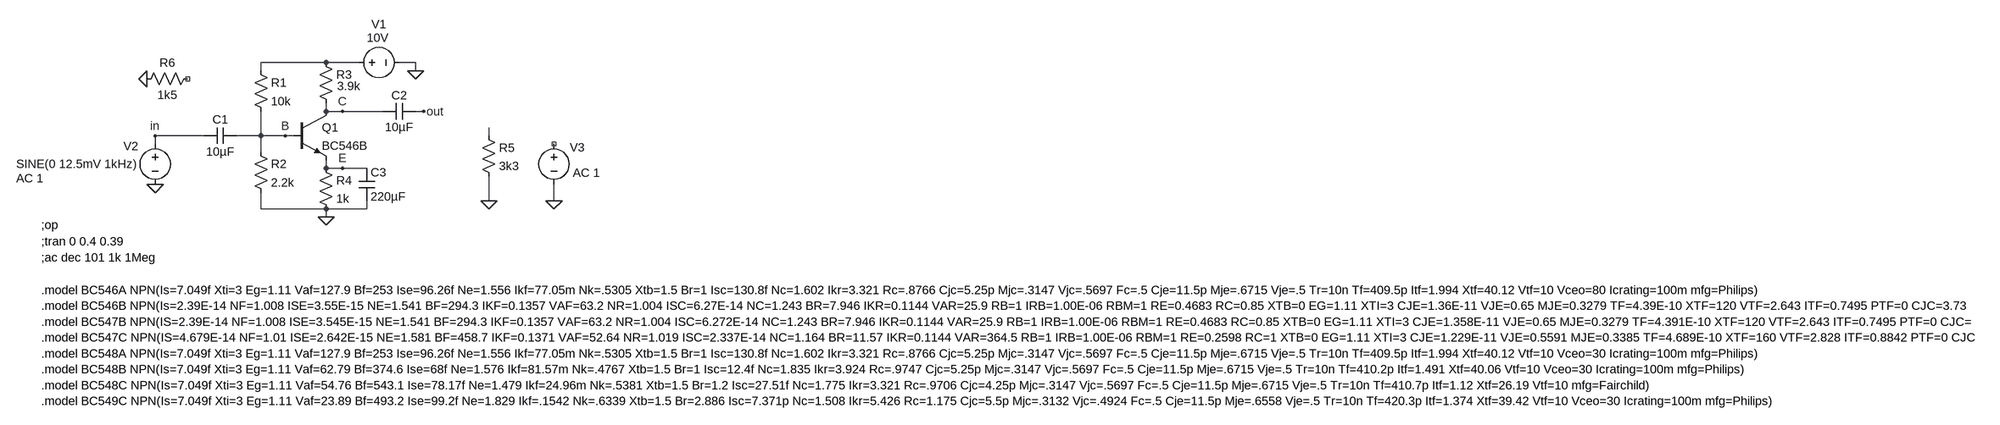
[diagram p0: schematic Tutorial_LTSpice_Ep10-AmplificadorBJT.asc]
Tutorial_LTSpice_Ep10-AmplificadorBJT.asc, the LTspice schematic file:
Version 4
SHEET 1 6060 876
WIRE -112 128 -240 128
WIRE -48 128 -112 128
WIRE 64 128 32 128
WIRE -240 144 -240 128
WIRE 64 144 64 128
WIRE -112 224 -112 208
WIRE -80 224 -112 224
WIRE 0 224 -80 224
WIRE 80 224 64 224
WIRE -352 272 -448 272
WIRE -240 272 -240 224
WIRE -240 272 -288 272
WIRE -192 272 -240 272
WIRE -176 272 -192 272
WIRE 208 272 208 256
WIRE -448 288 -448 272
WIRE -240 304 -240 272
WIRE -112 336 -112 320
WIRE -80 336 -112 336
WIRE -32 336 -80 336
WIRE 208 400 208 352
WIRE 336 400 336 368
WIRE -240 416 -240 384
WIRE -112 416 -240 416
WIRE -32 416 -32 400
WIRE -32 416 -112 416
WIRE -112 432 -112 416
FLAG -112 432 0
FLAG 64 144 0
FLAG -448 272 in
FLAG 80 224 out
FLAG -192 272 B
FLAG -80 224 C
FLAG -80 336 E
FLAG 208 400 0
FLAG 336 400 0
FLAG -448 368 0
FLAG -464 160 0
SYMBOL voltage -64 128 R270
WINDOW 0 60 56 VTop 2
WINDOW 3 33 54 VTop 2
SYMATTR InstName V1
SYMATTR Value 10V
SYMBOL voltage -448 272 R0
WINDOW 0 -62 21 Left 2
WINDOW 3 -273 56 Left 2
WINDOW 123 -273 84 Left 2
WINDOW 39 0 0 Left 0
SYMATTR InstName V2
SYMATTR Value SINE(0 12.5mV 1kHz)
SYMATTR Value2 AC 1
SYMBOL npn -176 224 R0
SYMATTR InstName Q1
SYMATTR Value BC546B
SYMBOL res -256 128 R0
SYMATTR InstName R1
SYMATTR Value 10k
SYMBOL res -256 288 R0
SYMATTR InstName R2
SYMATTR Value 2.2k
SYMBOL res -128 112 R0
WINDOW 3 38 62 Left 2
SYMATTR Value 3.9k
SYMATTR InstName R3
SYMBOL res -128 320 R0
SYMATTR InstName R4
SYMATTR Value 1k
SYMBOL cap -288 256 R90
WINDOW 0 0 32 VBottom 2
WINDOW 3 32 32 VTop 2
SYMATTR InstName C1
SYMATTR Value 10µF
SYMBOL cap 64 208 R90
WINDOW 0 0 32 VBottom 2
WINDOW 3 32 32 VTop 2
SYMATTR InstName C2
SYMATTR Value 10µF
SYMBOL cap -48 336 R0
SYMATTR InstName C3
SYMATTR Value 220µF
SYMBOL res 192 256 R0
SYMATTR InstName R5
SYMATTR Value 3k3
SYMBOL voltage 336 272 R0
WINDOW 0 31 23 Left 2
WINDOW 3 36 51 Left 2
WINDOW 123 37 73 Left 2
WINDOW 39 0 0 Left 0
SYMATTR InstName V3
SYMATTR Value ""
SYMATTR Value2 AC 1
SYMBOL res -368 144 R90
WINDOW 0 0 56 VBottom 2
WINDOW 3 32 56 VTop 2
SYMATTR InstName R6
SYMATTR Value 1k5
TEXT -672 448 Left 2 !;op
TEXT -672 576 Left 2 !.model BC546A NPN(Is=7.049f Xti=3 Eg=1.11 Vaf=127.9 Bf=253 Ise=96.26f Ne=1.556 Ikf=77.05m Nk=.5305 Xtb=1.5 Br=1 Isc=130.8f Nc=1.602 Ikr=3.321 Rc=.8766 Cjc=5.25p Mjc=.3147 Vjc=.5697 Fc=.5 Cje=11.5p Mje=.6715 Vje=.5 Tr=10n Tf=409.5p Itf=1.994 Xtf=40.12 Vtf=10 Vceo=80 Icrating=100m mfg=Philips)\n.model BC546B NPN(Is=2.39E-14 NF=1.008 ISE=3.55E-15 NE=1.541 BF=294.3 IKF=0.1357 VAF=63.2 NR=1.004 ISC=6.27E-14 NC=1.243 BR=7.946 IKR=0.1144 VAR=25.9 RB=1 IRB=1.00E-06 RBM=1 RE=0.4683 RC=0.85 XTB=0 EG=1.11 XTI=3 CJE=1.36E-11 VJE=0.65 MJE=0.3279 TF=4.39E-10 XTF=120 VTF=2.643 ITF=0.7495 PTF=0 CJC=3.73E-12 VJC=0.3997 MJC=0.2955 XCJC=0.6193 TR=1.00E-32 CJS=0 VJS=0.75 MJS=0.333 FC=0.9579 Vceo=65 Icrating=100m mfg=Philips)\n.model BC547B NPN(IS=2.39E-14 NF=1.008 ISE=3.545E-15 NE=1.541 BF=294.3 IKF=0.1357 VAF=63.2 NR=1.004 ISC=6.272E-14 NC=1.243 BR=7.946 IKR=0.1144 VAR=25.9 RB=1 IRB=1.00E-06 RBM=1 RE=0.4683 RC=0.85 XTB=0 EG=1.11 XTI=3 CJE=1.358E-11 VJE=0.65 MJE=0.3279 TF=4.391E-10 XTF=120 VTF=2.643 ITF=0.7495 PTF=0 CJC=3.728E-12 VJC=0.3997 MJC=0.2955 XCJC=0.6193 TR=1.00E-32 CJS=0 VJS=0.75 MJS=0.333 FC=0.9579 Vceo=45 Icrating=100m mfg=Philips)\n.model BC547C NPN(IS=4.679E-14 NF=1.01 ISE=2.642E-15 NE=1.581 BF=458.7 IKF=0.1371 VAF=52.64 NR=1.019 ISC=2.337E-14 NC=1.164 BR=11.57 IKR=0.1144 VAR=364.5 RB=1 IRB=1.00E-06 RBM=1 RE=0.2598 RC=1 XTB=0 EG=1.11 XTI=3 CJE=1.229E-11 VJE=0.5591 MJE=0.3385 TF=4.689E-10 XTF=160 VTF=2.828 ITF=0.8842 PTF=0 CJC=4.42E-12 VJC=0.1994 MJC=0.2782 XCJC=0.6193 TR=1.00E-32 CJS=0 VJS=0.75 MJS=0.333 FC=0.7936 Vceo=45 Icrating=100m mfg=Philips)\n.model BC548A NPN(Is=7.049f Xti=3 Eg=1.11 Vaf=127.9 Bf=253 Ise=96.26f Ne=1.556 Ikf=77.05m Nk=.5305 Xtb=1.5 Br=1 Isc=130.8f Nc=1.602 Ikr=3.321 Rc=.8766 Cjc=5.25p Mjc=.3147 Vjc=.5697 Fc=.5 Cje=11.5p Mje=.6715 Vje=.5 Tr=10n Tf=409.5p Itf=1.994 Xtf=40.12 Vtf=10 Vceo=30 Icrating=100m mfg=Philips)\n.model BC548B NPN(Is=7.049f Xti=3 Eg=1.11 Vaf=62.79 Bf=374.6 Ise=68f Ne=1.576 Ikf=81.57m Nk=.4767 Xtb=1.5 Br=1 Isc=12.4f Nc=1.835 Ikr=3.924 Rc=.9747 Cjc=5.25p Mjc=.3147 Vjc=.5697 Fc=.5 Cje=11.5p Mje=.6715 Vje=.5 Tr=10n Tf=410.2p Itf=1.491 Xtf=40.06 Vtf=10 Vceo=30 Icrating=100m mfg=Philips)\n.model BC548C NPN(Is=7.049f Xti=3 Eg=1.11 Vaf=54.76 Bf=543.1 Ise=78.17f Ne=1.479 Ikf=24.96m Nk=.5381 Xtb=1.5 Br=1.2 Isc=27.51f Nc=1.775 Ikr=3.321 Rc=.9706 Cjc=4.25p Mjc=.3147 Vjc=.5697 Fc=.5 Cje=11.5p Mje=.6715 Vje=.5 Tr=10n Tf=410.7p Itf=1.12 Xtf=26.19 Vtf=10 mfg=Fairchild)\n.model BC549C NPN(Is=7.049f Xti=3 Eg=1.11 Vaf=23.89 Bf=493.2 Ise=99.2f Ne=1.829 Ikf=.1542 Nk=.6339 Xtb=1.5 Br=2.886 Isc=7.371p Nc=1.508 Ikr=5.426 Rc=1.175 Cjc=5.5p Mjc=.3132 Vjc=.4924 Fc=.5 Cje=11.5p Mje=.6558 Vje=.5 Tr=10n Tf=420.3p Itf=1.374 Xtf=39.42 Vtf=10 Vceo=30 Icrating=100m mfg=Philips)
TEXT -672 480 Left 2 !;tran 0 0.4 0.39
TEXT -672 512 Left 2 !;ac dec 101 1k 1Meg

The netlist it stands for:
* Tutorial_LTSpice_Ep10-AmplificadorBJT.asc
V1 N001 0 10V
V2 in 0 SINE(0 12.5mV 1kHz) AC 1
Q1 C B E 0 BC546B
R1 N001 B 10k
R2 B 0 2.2k
R3 N001 C 3.9k
R4 E 0 1k
C1 B in 10µF
C2 out C 10µF
C3 E 0 220µF
R5 N002 0 3k3
V3 NC_01 0 AC 1
R6 NC_02 0 1k5
.model NPN NPN
.model PNP PNP
.lib standard.bjt
;op
.model BC546A NPN(Is=7.049f Xti=3 Eg=1.11 Vaf=127.9 Bf=253 Ise=96.26f Ne=1.556 Ikf=77.05m Nk=.5305 Xtb=1.5 Br=1 Isc=130.8f Nc=1.602 Ikr=3.321 Rc=.8766 Cjc=5.25p Mjc=.3147 Vjc=.5697 Fc=.5 Cje=11.5p Mje=.6715 Vje=.5 Tr=10n Tf=409.5p Itf=1.994 Xtf=40.12 Vtf=10 Vceo=80 Icrating=100m mfg=Philips)
.model BC546B NPN(Is=2.39E-14 NF=1.008 ISE=3.55E-15 NE=1.541 BF=294.3 IKF=0.1357 VAF=63.2 NR=1.004 ISC=6.27E-14 NC=1.243 BR=7.946 IKR=0.1144 VAR=25.9 RB=1 IRB=1.00E-06 RBM=1 RE=0.4683 RC=0.85 XTB=0 EG=1.11 XTI=3 CJE=1.36E-11 VJE=0.65 MJE=0.3279 TF=4.39E-10 XTF=120 VTF=2.643 ITF=0.7495 PTF=0 CJC=3.73E-12 VJC=0.3997 MJC=0.2955 XCJC=0.6193 TR=1.00E-32 CJS=0 VJS=0.75 MJS=0.333 FC=0.9579 Vceo=65 Icrating=100m mfg=Philips)
.model BC547B NPN(IS=2.39E-14 NF=1.008 ISE=3.545E-15 NE=1.541 BF=294.3 IKF=0.1357 VAF=63.2 NR=1.004 ISC=6.272E-14 NC=1.243 BR=7.946 IKR=0.1144 VAR=25.9 RB=1 IRB=1.00E-06 RBM=1 RE=0.4683 RC=0.85 XTB=0 EG=1.11 XTI=3 CJE=1.358E-11 VJE=0.65 MJE=0.3279 TF=4.391E-10 XTF=120 VTF=2.643 ITF=0.7495 PTF=0 CJC=3.728E-12 VJC=0.3997 MJC=0.2955 XCJC=0.6193 TR=1.00E-32 CJS=0 VJS=0.75 MJS=0.333 FC=0.9579 Vceo=45 Icrating=100m mfg=Philips)
.model BC547C NPN(IS=4.679E-14 NF=1.01 ISE=2.642E-15 NE=1.581 BF=458.7 IKF=0.1371 VAF=52.64 NR=1.019 ISC=2.337E-14 NC=1.164 BR=11.57 IKR=0.1144 VAR=364.5 RB=1 IRB=1.00E-06 RBM=1 RE=0.2598 RC=1 XTB=0 EG=1.11 XTI=3 CJE=1.229E-11 VJE=0.5591 MJE=0.3385 TF=4.689E-10 XTF=160 VTF=2.828 ITF=0.8842 PTF=0 CJC=4.42E-12 VJC=0.1994 MJC=0.2782 XCJC=0.6193 TR=1.00E-32 CJS=0 VJS=0.75 MJS=0.333 FC=0.7936 Vceo=45 Icrating=100m mfg=Philips)
.model BC548A NPN(Is=7.049f Xti=3 Eg=1.11 Vaf=127.9 Bf=253 Ise=96.26f Ne=1.556 Ikf=77.05m Nk=.5305 Xtb=1.5 Br=1 Isc=130.8f Nc=1.602 Ikr=3.321 Rc=.8766 Cjc=5.25p Mjc=.3147 Vjc=.5697 Fc=.5 Cje=11.5p Mje=.6715 Vje=.5 Tr=10n Tf=409.5p Itf=1.994 Xtf=40.12 Vtf=10 Vceo=30 Icrating=100m mfg=Philips)
.model BC548B NPN(Is=7.049f Xti=3 Eg=1.11 Vaf=62.79 Bf=374.6 Ise=68f Ne=1.576 Ikf=81.57m Nk=.4767 Xtb=1.5 Br=1 Isc=12.4f Nc=1.835 Ikr=3.924 Rc=.9747 Cjc=5.25p Mjc=.3147 Vjc=.5697 Fc=.5 Cje=11.5p Mje=.6715 Vje=.5 Tr=10n Tf=410.2p Itf=1.491 Xtf=40.06 Vtf=10 Vceo=30 Icrating=100m mfg=Philips)
.model BC548C NPN(Is=7.049f Xti=3 Eg=1.11 Vaf=54.76 Bf=543.1 Ise=78.17f Ne=1.479 Ikf=24.96m Nk=.5381 Xtb=1.5 Br=1.2 Isc=27.51f Nc=1.775 Ikr=3.321 Rc=.9706 Cjc=4.25p Mjc=.3147 Vjc=.5697 Fc=.5 Cje=11.5p Mje=.6715 Vje=.5 Tr=10n Tf=410.7p Itf=1.12 Xtf=26.19 Vtf=10 mfg=Fairchild)
.model BC549C NPN(Is=7.049f Xti=3 Eg=1.11 Vaf=23.89 Bf=493.2 Ise=99.2f Ne=1.829 Ikf=.1542 Nk=.6339 Xtb=1.5 Br=2.886 Isc=7.371p Nc=1.508 Ikr=5.426 Rc=1.175 Cjc=5.5p Mjc=.3132 Vjc=.4924 Fc=.5 Cje=11.5p Mje=.6558 Vje=.5 Tr=10n Tf=420.3p Itf=1.374 Xtf=39.42 Vtf=10 Vceo=30 Icrating=100m mfg=Philips)
;tran 0 0.4 0.39
;ac dec 101 1k 1Meg
.backanno
.end